# EAGLE design IMU (EAGLE 9.6.1)
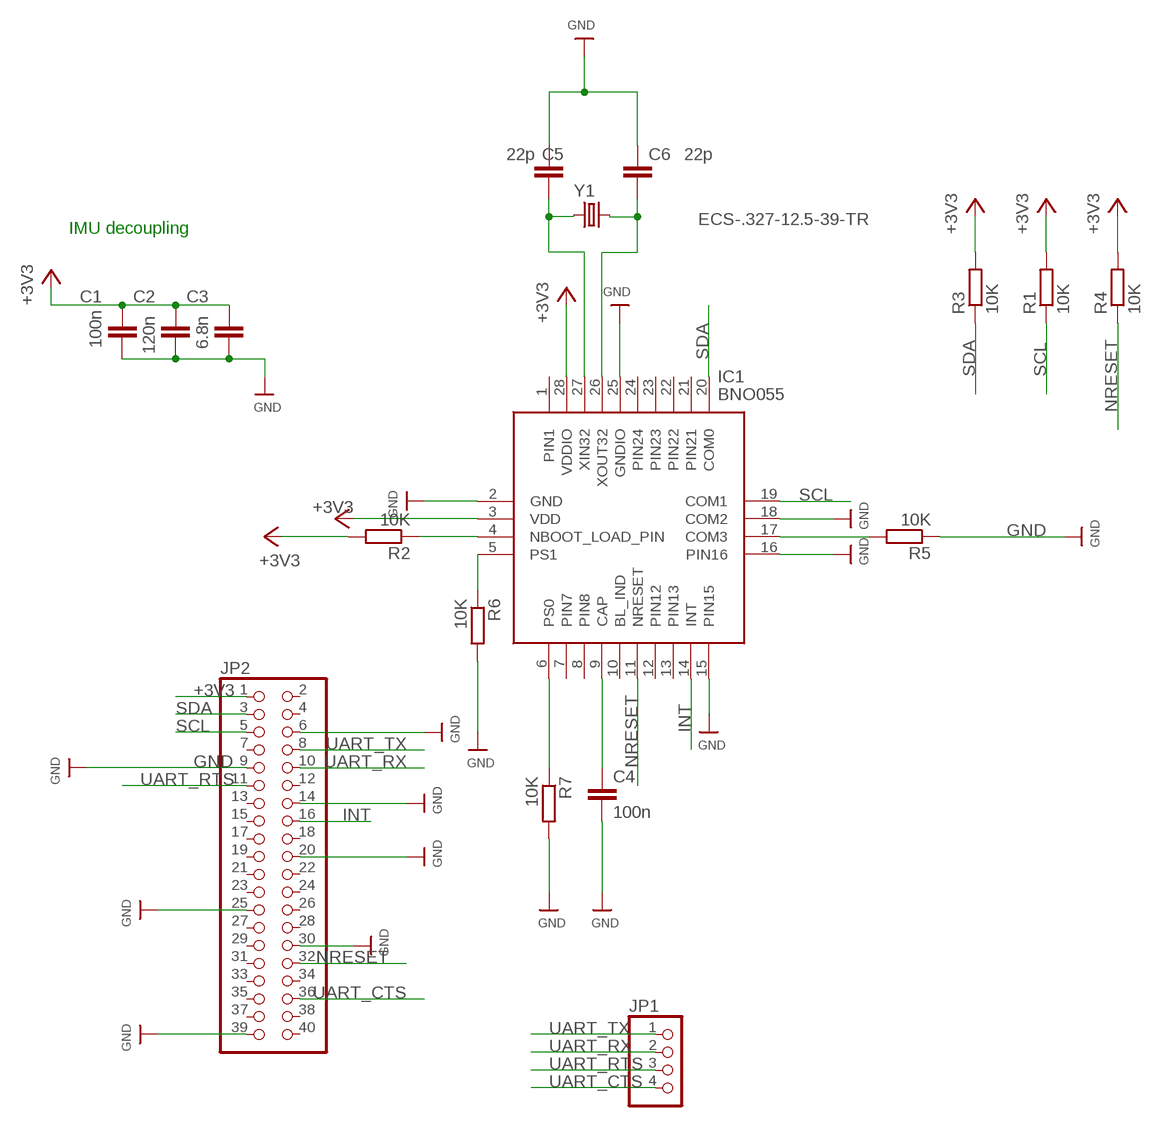
[diagram p0: schematic, sheet 1]

## Parts
C1  100n  C-EUC0805  [C0805]
C2  120n  C-EUC0805  [C0805]
C3  6.8n  C-EUC0805  [C0805]
C4  100n  C-EUC0805  [C0805]
C5  22p  C-EUC0805  [C0805]
C6  22p  C-EUC0805  [C0805]
IC1  BNO055  [BNO055]
JP1  PINHD-1X4  [1X04]
JP2  PINHD-2X20  [2X20]
R1  10K  R-EU_R0805  [R0805]
R2  10K  R-EU_R0805  [R0805]
R3  10K  R-EU_R0805  [R0805]
R4  10K  R-EU_R0805  [R0805]
R5  10K  R-EU_R0805  [R0805]
R6  10K  R-EU_R0805  [R0805]
R7  10K  R-EU_R0805  [R0805]
Y1  ECS-.327-12.5-39-TR  [ECS-.327-12.5-39-TR]

## Nets
+3V3: C1.1 C2.1 C3.1 IC1.3(VDD) IC1.28(VDDIO) JP2.1 R1.2 R2.2 R3.2 R4.2
ADD_SEL: IC1.17(COM3) R5.2
CAP: C4.1 IC1.9(CAP)
GND: C1.2 C2.2 C3.2 C4.2 C5.1 C6.1 IC1.2(GND) IC1.15(PIN15) IC1.16(PIN16) IC1.18(COM2) IC1.25(GNDIO) JP2.6 JP2.9 JP2.14 JP2.20 JP2.25 JP2.30 JP2.39 R5.1 R6.2 R7.2
INT: IC1.14(INT) JP2.16
NBOOT: IC1.4(NBOOT_LOAD_PIN) R2.1
NRESET: IC1.11(NRESET) JP2.32 R4.1
PS0: IC1.6(PS0) R7.1
PS1: IC1.5(PS1) R6.1
SCL: IC1.19(COM1) JP2.5 R1.1
SDA: IC1.20(COM0) JP2.3 R3.1
UART_CTS: JP1.4 JP2.36
UART_RTS: JP1.3 JP2.11
UART_RX: JP1.2 JP2.10
UART_TX: JP1.1 JP2.8
XIN: C5.2 IC1.27(XIN32) Y1.1
XOUT: C6.2 IC1.26(XOUT32) Y1.2
Unconnected: IC1.1(PIN1) IC1.7(PIN7) IC1.8(PIN8) IC1.10(BL_IND) IC1.12(PIN12) IC1.13(PIN13) IC1.21(PIN21) IC1.22(PIN22) IC1.23(PIN23) IC1.24(PIN24) JP2.2 JP2.4 JP2.7 JP2.12 JP2.13 JP2.15 JP2.17 JP2.18 JP2.19 JP2.21 JP2.22 JP2.23 JP2.24 JP2.26 JP2.27 JP2.28 JP2.29 JP2.31 JP2.33 JP2.34 JP2.35 JP2.37 JP2.38 JP2.40

## Notes on the sheet
- IMU decoupling

## Library data of the parts
C1-C6 = rcl:C-EU: CAPACITOR, European symbol; SPICEPREFIX: C
IC1 = BNO055:BNO055: IMUs - Inertial Measurement Units Absolute Orientation 9-Axis Sensor Source: Datasheet <https://ae-bst.resource.bosch.com/media/_tech/media/datasheets/BST_BNO055_DS000_14.pdf>; DESCRIPTION: IMUs - Inertial Measurement Units Absolute Orientation 9-Axis Sensor; HEIGHT: 1mm; MANUFACTURER_NAME: Bosch Sensortec; MANUFACTURER_PART_NUMBER: BNO055; MOUSER_PART_NUMBER: 262-BNO055; MOUSER_PRICE-STOCK: https://www.mouser.co.uk/ProductDetail/Bosch-Sensortec/BNO055?qs=QhAb4EtQfbV8Z2YmISucWw%3D%3D
JP1 = pinhead:PINHD-1X4: PIN HEADER
JP2 = pinhead:PINHD-2X20: PIN HEADER
R1-R7 = resistor:R-EU_: RESISTOR, European symbol
Y1 = Crystals_Oscillators:ECS-.327-12.5-39-TR: CRYSTAL 32.7680KHZ 12.5PF SMD Manufacturer's datasheet <https://ecsxtal.com/store/pdf/ECX_39.pdf>; CREATED_BY: PCBLayout.com; DIGIKEY_PART_NUMBER: XC1658TR-ND; MANUFACTURER: ECS Inc.; MPN: ECS-.327-12.5-39-TR; PACKAGE: 2-SMD

## Board
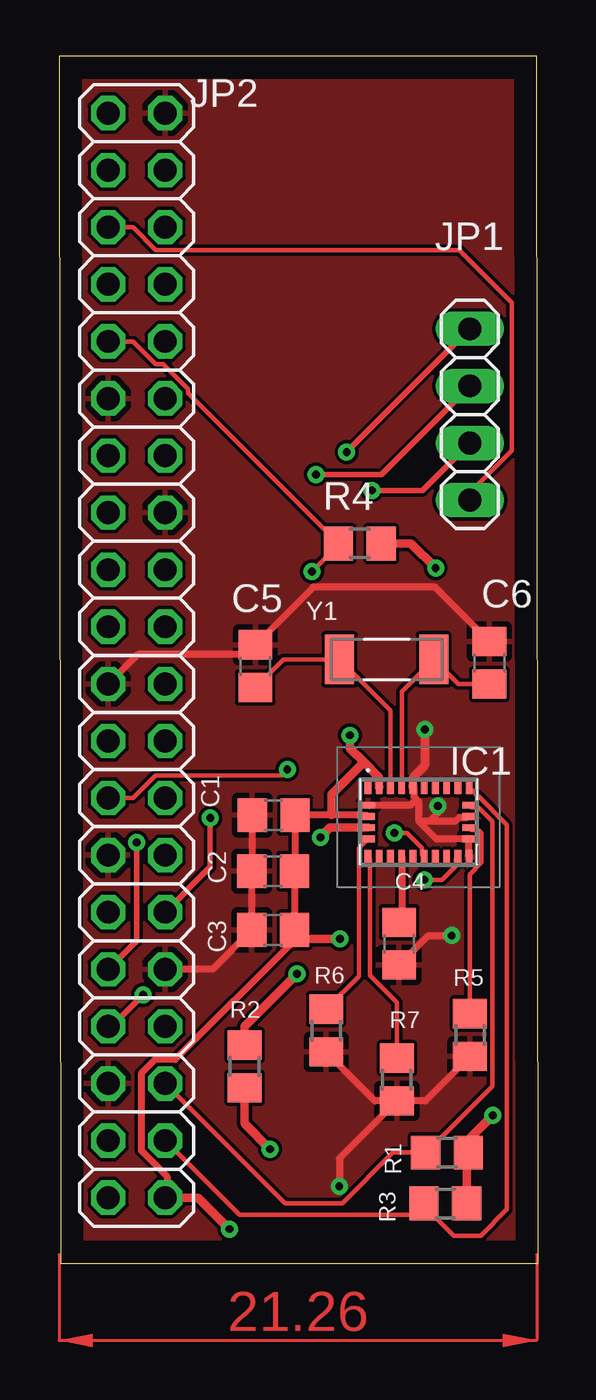
[diagram p1: board, top side]
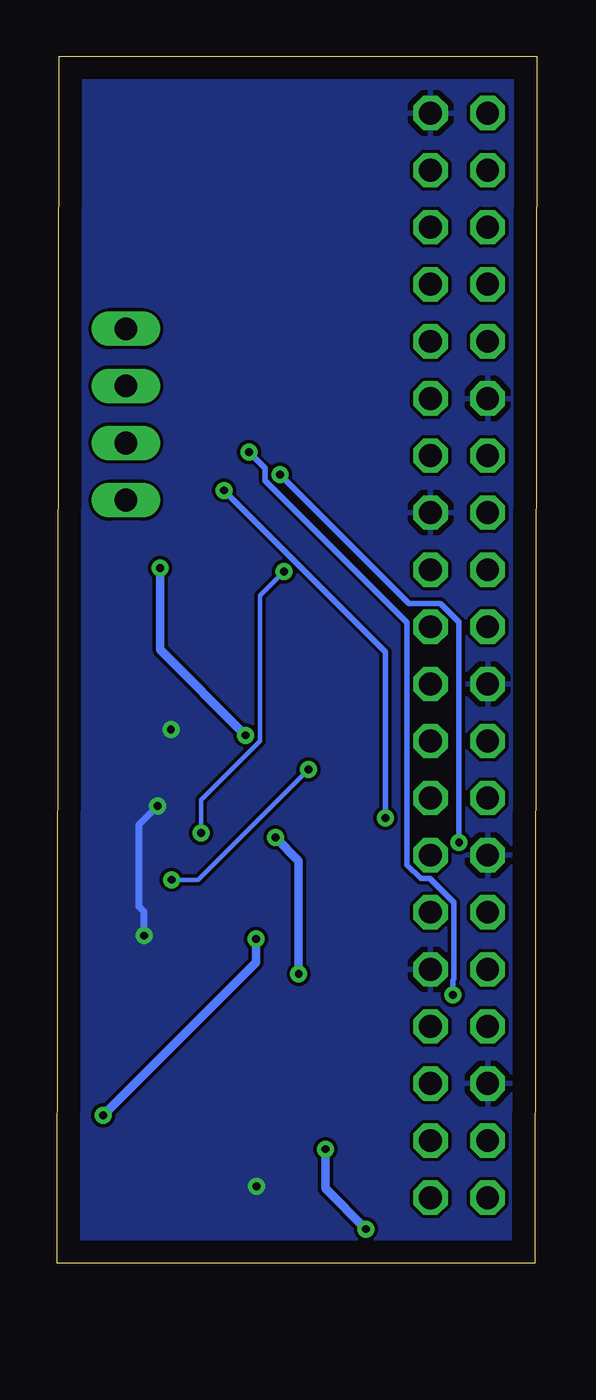
[diagram p2: board, bottom side, seen from below]

Size 21.34 x 53.71 mm. Coordinates in mm from the lower left corner, seen from the top.
Outline: 0.08,0 21.34,0 21.26,53.71 0,53.71 0.08,0
Copper layers (1*16): Top 0.035mm / dielectric 1.5mm / Bottom 0.035mm
Design rules "default": minimum track width 6mil, minimum drill 0.35mm, track to track 6mil, track to pad 6mil, pad to pad 6mil, via to via 6mil, smd to smd 6mil, copper to edge 40mil, drill to drill 6mil, minimum pad ring 10mil, minimum via ring 8mil, stop-mask expansion 4mil, vias tented up to drill 0mil, thermal gap 10mil

### Footprints (pad centres in the part's own frame; a part is rotated, then mirrored left to right if it is on the bottom)
C0805 = smd 1.3 x 1.5: 1 -0.95,0; 2 0.95,0
BNO055 = smd 0.3 x 0.6: 1 -2.25,1.55; 6 -2.25,-1.55; 7 -1.75,-1.55; 8 -1.25,-1.55; 9 -0.75,-1.55; 10 -0.25,-1.55; 11 0.25,-1.55; 12 0.75,-1.55; 13 1.25,-1.55; 14 1.75,-1.55; 15 2.25,-1.55; 20 2.25,1.55; 21 1.75,1.55; 22 1.25,1.55; 23 0.75,1.55; 24 0.25,1.55; 25 -0.25,1.55; 26 -0.75,1.55; 27 -1.25,1.55; 28 -1.75,1.55 | smd 0.6 x 0.3: 2 -2.25,0.75; 3 -2.25,0.25; 4 -2.25,-0.25; 5 -2.25,-0.75; 16 2.25,-0.75; 17 2.25,-0.25; 18 2.25,0.25; 19 2.25,0.75
1X04 = drill 1.016 long: 1 -3.81,0; 2 -1.27,0; 3 1.27,0; 4 3.81,0
2X20 = drill 1.016 octagon: 1 -24.13,-1.27; 2 -24.13,1.27; 3 -21.59,-1.27; 4 -21.59,1.27; 5 -19.05,-1.27; 6 -19.05,1.27; 7 -16.51,-1.27; 8 -16.51,1.27; 9 -13.97,-1.27; 10 -13.97,1.27; 11 -11.43,-1.27; 12 -11.43,1.27; 13 -8.89,-1.27; 14 -8.89,1.27; 15 -6.35,-1.27; 16 -6.35,1.27; 17 -3.81,-1.27; 18 -3.81,1.27; 19 -1.27,-1.27; 20 -1.27,1.27; 21 1.27,-1.27; 22 1.27,1.27; 23 3.81,-1.27; 24 3.81,1.27; 25 6.35,-1.27; 26 6.35,1.27; 27 8.89,-1.27; 28 8.89,1.27; 29 11.43,-1.27; 30 11.43,1.27; 31 13.97,-1.27; 32 13.97,1.27; 33 16.51,-1.27; 34 16.51,1.27; 35 19.05,-1.27; 36 19.05,1.27; 37 21.59,-1.27; 38 21.59,1.27; 39 24.13,-1.27; 40 24.13,1.27
R0805 = smd 1.3 x 1.5: 1 -0.95,0; 2 0.95,0
ECS-.327-12.5-39-TR = smd 1.3 x 2.2: 1 -2.1,0; 2 2.1,0

### Placement (x,y rotation side)
C1  9.55,19.94 180 top
C2  9.52,17.45 180 top
C3  9.52,14.83 180 top
C4  15.14,14.22 270 top
C5  8.74,26.57 270 top
C6  19.15,26.72 270 top
IC1  16,19.63 0 top
JP1  18.29,37.77 270 top
JP2  3.45,27.05 90 top
R1  17.27,4.93 0 top
R2  8.25,8.76 270 top
R3  17.2,2.67 0 top
R4  13.39,32.03 0 top
R5  18.29,10.16 90 top
R6  11.89,10.36 270 top
R7  15.04,8.18 270 top
Y1  14.58,26.87 0 top

### Tracks (layer width: path | path; a pad name or v marks a point on that pad's centre or on a via)
+3V3  (via drill 0.35)
  Top 0.305: IC1.3 13.71,19.93 13.33,19.93 13.32,19.94 12.12,19.94 C1.1 10.5,17.48 C2.1 C3.1 10.47,14.38 5.17,9.07 4.28,9.07 3.66,8.44 3.66,5.02 4.8,3.88 4.8,3 JP2.1
  Top 0.381: R3.2 18.15,4.85 R1.2 18.22,5.5 v19.3,6.58 | R4.2 15.67,32.03 v16.76,30.94 | IC1.28 14.24,21.63 13.57,22.3 | v12.95,23.49 12.95,22.92 13.57,22.3 | 13.57,22.3 12.12,20.85 12.12,19.94 | 10.69,14.83 C3.1 10.88,14.43 v12.5,14.43 | JP2.1 6.2,2.92 v7.59,1.52 | v9.4,5.08 8.25,6.22 R2.2
  Bottom 0.381: v16.76,30.94 16.76,27.3 v12.95,23.49 | v12.5,14.43 12.5,13.39 v19.3,6.58 | v7.59,1.52 9.4,3.33 v9.4,5.08
ADD_SEL
  Top 0.203: R5.2 18.29,17.31 18.81,17.83 18.81,19.14 18.66,19.29 18.35,19.29 IC1.17
CAP
  Top 0.305: IC1.9 15.25,15.29 C4.1
GND  (via drill 0.35)
  Top 0.305: C6.1 16.72,30.1 11.32,30.1 C5.1 8.31,27.09 3.49,27.09 JP2.20 | IC1.25 15.8,21.14 15.8,20.76 15.91,20.64 | 16,19.68 16,20.55 15.91,20.64 | 16,19.68 16.51,19.68 | 16.51,19.68 17.67,19.68 17.83,19.84 18.21,19.84 | IC1.2 15.66,20.38 15.91,20.64 | C1.2 8.6,17.48 C2.2 C3.2 6.82,13.08 JP2.9 | R5.1 16.31,7.23 R7.2 | R7.2 14.07,7.23 R6.2 | R7.2 12.47,4.66 v12.47,3.43 | 16,19.68 16.8,18.88 IC1.16 IC1.15 | C4.2 16.44,14.58 v17.48,14.58 | v16.87,20.35 16.87,20.04 16.51,19.68
  Top 0.381: IC1.25 15.76,21.63 16.28,22.15 v16.28,23.75
  Bottom 0.305: v17.48,14.58 17.48,15.65 17.7,15.87 17.7,19.52 v16.87,20.35
  pour Top: 0,53.72 21.23,53.72 21.23,-0.89 0,-0.89
  pour Bottom: -1.14,53.34 -1.14,3.17 3.68,-1.65 18.54,-1.65 22.48,2.29 22.48,50.55 19.56,53.47 -1.02,53.47
INT  (via drill 0.35)
  Top 0.203: JP2.16 3.29,20.7 4.3,21.72 9.91,21.72 v10.16,21.97 | IC1.14 17.66,17.99 17.66,17.68 17.05,17.07 v16.26,17.07
  Bottom 0.203: v10.16,21.97 15.06,17.07 v16.26,17.07
NBOOT  (via drill 0.35)
  Top 0.381: R2.1 8.25,10.54 v10.59,12.88 | v11.63,18.95 12.07,19.38 IC1.4
  Bottom 0.381: v10.59,12.88 10.59,17.91 v11.63,18.95
NRESET  (via drill 0.35)
  Top 0.203: JP2.32 3.29,41.02 4.3,40 4.64,40 5.74,38.9 5.74,38.72 R4.1 12.44,31.97 v11.25,30.78 | IC1.11 16.16,18.18 16.16,18.49 15.49,19.15 v14.94,19.15
  Bottom 0.203: v14.94,19.15 14.94,20.62 12.32,23.23 12.32,29.71 v11.25,30.78
PS0
  Top 0.203: IC1.6 13.85,17.99 13.85,12.8 15.04,11.62 R7.1
PS1
  Top 0.203: IC1.5 13.51,18.64 13.5,18.64 13.35,18.49 13.35,12.77 R6.1
SCL
  Top 0.203: JP2.5 10.06,2.67 12.61,2.67 14.86,4.93 R1.1 16.35,4.93 19.29,7.87 19.29,19.65 18.66,20.29 18.35,20.29 IC1.19
SDA
  Top 0.203: JP2.3 8.03,2.16 15.74,2.16 R3.1 16.25,2.55 17.57,1.23 18.77,1.23 19.94,2.39 19.94,19.51 18.66,20.79 18.65,20.79 IC1.20
UART_CTS
  Top 0.203: JP1.4 18.29,34.3 20.16,36.17 20.16,42.75 17.82,45.09 4.3,45.09 3.29,46.1 JP2.36
UART_RTS  (via drill 0.35)
  Top 0.254: JP1.3 16.18,34.39 v13.92,34.39 | v6.73,19.81 6.73,17.63 JP2.11
  Bottom 0.254: v13.92,34.39 6.73,27.2 v6.73,19.81
UART_RX  (via drill 0.35)
  Top 0.254: JP1.2 14.35,35.1 v11.43,35.1 | v3.45,18.72 3.45,14.35 JP2.10
  Bottom 0.254: v11.43,35.1 5.69,29.36 4.29,29.36 3.45,28.52 v3.45,18.72
UART_TX  (via drill 0.35)
  Top 0.254: JP1.1 v12.8,36.09 | v3.73,11.94 2.34,10.54 JP2.8
  Bottom 0.254: v3.73,11.94 3.73,12.6 3.68,12.65 3.68,16.05 4.75,17.12 5.16,17.12 5.77,17.73 5.77,28.51 12.09,34.83 12.09,35.38 v12.8,36.09
XIN
  Top 0.203: C5.2 9.99,26.87 Y1.1 14.75,24.6 IC1.27
XOUT
  Top 0.203: IC1.26 15.25,25.45 Y1.2 17.78,25.77 C6.2
(copper drawn outside any net)
  shapes: Top area x2